# Altium project MiniPC MB GOST.PrjPcb (part 13 of 31)

## Sheet Converter 3V3-VADJ.SchDoc
size 420 x 297 mm; Author: ALTIUM GOSTBOM2.0 KEV; SheetNumber: 42; SheetTotal: 48
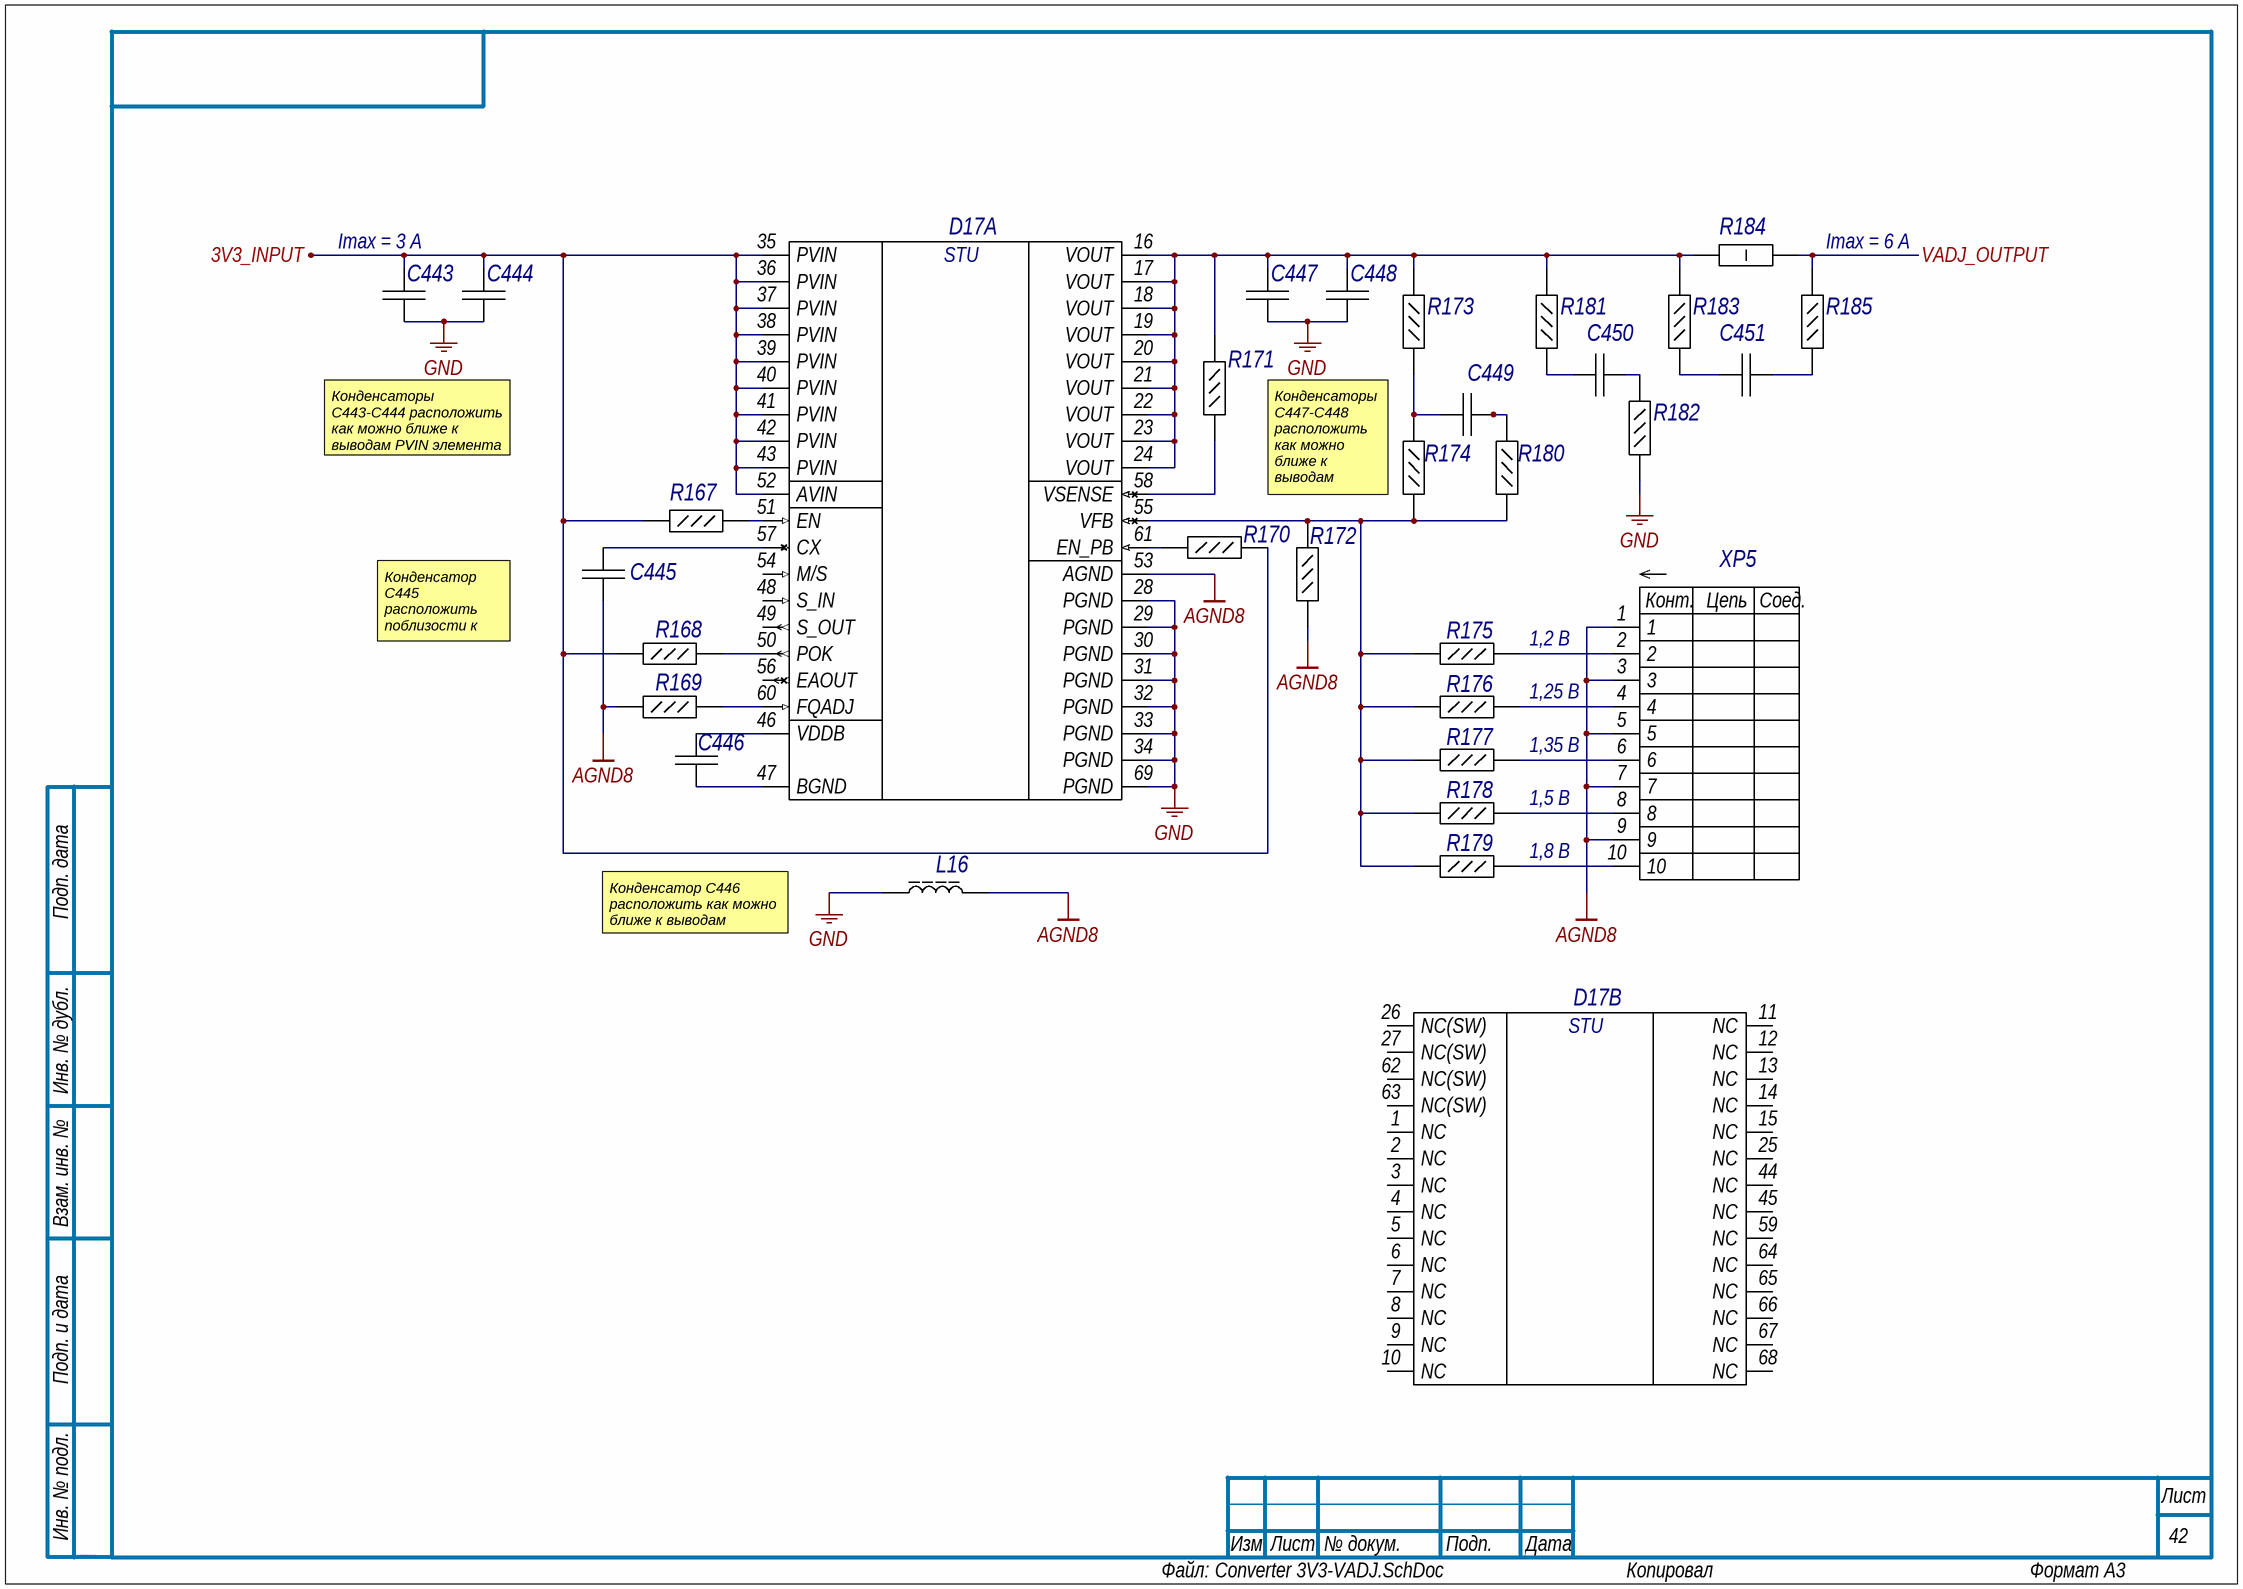
[diagram p16: Converter 3V3-VADJ.SchDoc]

### Parts
C443  GRM31CR61E226KE15L  [CAPC3216X180X55ML20T25]  (value not drawn)
C444  GRM31CR61E226KE15L  [CAPC3216X180X55ML20T25]  (value not drawn)
C445  VJ0402Y153JXQPW1BC  [CAPC1005X55X23ML05T8]  (value not drawn)
C446  GRM155R61A224KE19D  [CAPC1005X55X25NL05T10]  (value not drawn)
C447  C3216X5R1A476M160AB  [CAPC3216X180X20ML20]  (value not drawn)
C448  C3216X5R1A476M160AB  [CAPC3216X180X20ML20]  (value not drawn)
C449  C1005C0G1H220J050BA  [CAPC1005X55X10LL05]  (value not drawn)
C450  GRM155R61A224KE19D  [CAPC1005X55X25NL05T10]  (value not drawn)
C451  CGB2A1X5R1E105K033BC  [CAPC1005X33X10LL5]  (value not drawn)
D17  EN6360QI  [ALTR-QFN-68_A-305_V]  (value not drawn)  (parts A,B of 2)
L16  742792609  [SMD-0603]  (value not drawn)
R167  ERJ-2GE0R00X  [RESC1005X40X25LL05T05]  (value not drawn)
R168  ERJ-2RKF1003X  [RESC1005X40X25LL05T05]  (value not drawn)
R169  ERJ-2RKF5491X  [RESC1005X40X25LL05T05]  (value not drawn)
R170  ERJ-2RKF1002X  [RESC1005X40X25LL05T05]  (value not drawn)
R171  ERJ-2GE0R00X  [RESC1005X40X25LL05T05]  (value not drawn)
R172  CRCW0402191KFKED  [RESC1005X40X25LL05T05]  (value not drawn)
R173  ERJ-2GE0R00X  [RESC1005X40X25LL05T05]  (value not drawn)
R174  CRCW0402160KFKED  [RESC1005X40X25LL05T05]  (value not drawn)
R175  CRCW0402976KFKED  [RESC1005X40X25LL05T05]  (value not drawn)
R176  CRCW0402649KFKED  [RESC1005X40X25LL05T05]  (value not drawn)
R177  CRCW0402390KFKED  [RESC1005X40X25LL05T05]  (value not drawn)
R178  ERJ-2RKF2403X  [RESC1005X40X25LL05T05]  (value not drawn)
R179  CRCW0402137KFKED  [RESC1005X40X25LL05T05]  (value not drawn)
R180  ERJ-2RKF1502X  [RESC1005X40X25LL05T05]  (value not drawn)
R181  ERJ-2RKF1000X  [RESC1005X40X25LL05T05]  (value not drawn)
R182  ERJ-2RKF1000X  [RESC1005X40X25LL05T05]  (value not drawn)
R183  ERJ-2RKF1002X  [RESC1005X40X25LL05T05]  (value not drawn)
R184  WSLP12061L000FEA  [RESC3216X89X104LL25T25]  (value not drawn)
R185  ERJ-2RKF1002X  [RESC1005X40X25LL05T05]  (value not drawn)
XP5  TSM-105-01-T-DV-TR  [SMTC-TSM-105-01-T-DV_V]  (value not drawn)

### Ports
3V3_INPUT, VADJ_OUTPUT

### Nets
AGND8: C445.1 D17.53(AGND) L16.2 R169.2 R172.1 XP5.1 XP5.3 XP5.5 XP5.7 XP5.9
GND: C443.1 C444.1 C447.1 C448.1 D17.28(PGND) D17.29(PGND) D17.30(PGND) D17.31(PGND) D17.32(PGND) D17.33(PGND) D17.34(PGND) D17.69(PGND) L16.1 R182.1
3V3_OUTPUT: C443.2 C444.2 D17.35(PVIN) D17.36(PVIN) D17.37(PVIN) D17.38(PVIN) D17.39(PVIN) D17.40(PVIN) D17.41(PVIN) D17.42(PVIN) D17.43(PVIN) D17.52(AVIN) R167.2 R168.2 R170.1 ; port 3V3_INPUT
VADJ: R184.1 R185.2 ; port VADJ_OUTPUT
NetC445_2: C445.2 D17.57(CX)
NetC446_1: C446.1 D17.47(BGND)
NetC446_2: C446.2 D17.46(VDDB)
NetC447_2: C447.2 C448.2 D17.16(VOUT) D17.17(VOUT) D17.18(VOUT) D17.19(VOUT) D17.20(VOUT) D17.21(VOUT) D17.22(VOUT) D17.23(VOUT) D17.24(VOUT) R171.2 R173.1 R181.1 R183.2 R184.2
NetC449_1: C449.1 R173.2 R174.1
NetC449_2: C449.2 R180.1
NetC450_1: C450.1 R181.2
NetC450_2: C450.2 R182.2
NetC451_1: C451.1 R185.1
NetC451_2: C451.2 R183.1
NetD17_50: D17.50(POK) R168.1
NetD17_51: D17.51(EN) R167.1
NetD17_55: D17.55(VFB) R172.2 R174.2 R175.2 R176.2 R177.2 R178.2 R179.2 R180.2
NetD17_58: D17.58(VSENSE) R171.1
NetD17_60: D17.60(FQADJ) R169.1
NetD17_61: D17.61(EN_PB) R170.2
NetR175_1: R175.1 XP5.2
NetR176_1: R176.1 XP5.4
NetR177_1: R177.1 XP5.6
NetR178_1: R178.1 XP5.8
NetR179_1: R179.1 XP5.10

Not connected (* = marked no-connect by the designer): D17 1(NC) 2(NC) 3(NC) 4(NC) 5(NC) 6(NC) 7(NC) 8(NC) 9(NC) 10(NC) 11(NC) 12(NC) 13(NC) 14(NC) 15(NC) 25(NC) 26(NC(SW)) 27(NC(SW)) 44(NC) 45(NC) 48(S_IN) 49(S_OUT) 54(M/S) 56(EAOUT) 59(NC) 62(NC(SW)) 63(NC(SW)) 64(NC) 65(NC) 66(NC) 67(NC) 68(NC)

### Notes on the sheet
- Imax = 3 А
- Imax = 6 А
- Конденсаторы C443-C444 расположить как можно ближе к выводам PVIN элемента D17.
- Конденсаторы C447-C448 расположить как можно ближе к выводам PVOUT элемента D17.
- Конденсатор C445 расположить поблизости к D17:57.
- 1,2 В
- 1,25 В
- 1,35 В
- 1,5 В
- 1,8 В
- Конденсатор C446 расположить как можно ближе к выводам D17:46-D17:47.
- Подп. дата
- Инв. № дубл.
- Взам. инв. №
- Подп. и дата
- Инв. № подл.
- Изм.
- Лист
- № докум.
- Подп.
- Дата
- ALTIUM GOSTBOM2.0 KEV
- Файл:
- Копировал
- Формат А3
- (in symbol E39) Конт.; Цепь; Соед.
- (in symbol E106, part A) STU
- (in symbol E106, part B) STU

### Library data of the parts
C443 = E5: Chip Capacitor, 22 uF, +/- 10%, 25 V, -55 to 85 degC, 1206 (3216 Metric), RoHS, Tape and Reel; Тип элемента: Конденсатор; Capacitance: 22 uF; Case\/Package: 1206; Type (Capacitors): X5R; Voltage Rating: 25 V; Old_des: C37; New_des: C363; UID: E5; Component Kind: Standard; Case Code (Imperial): 1206; Case Code (Metric): 3216; ComponentLink1Description: Manufacturer URL; ComponentLink1URL: http://www.murata.com/; ComponentLink2Description: Datasheet; ComponentLink2URL: http://search.murata.co.jp/Ceramy/image/img/A01X/G101/ENG/GRM31CR61E226KE15-01.pdf; DatasheetVersion: 03/2016; Length: 3.2 mm; Max Operating Temperature: 85 degC; Min Operating Temperature: -55 degC; Mounting Technology: Surface Mount; Package Quantity: 2000; PackageDescription: 2-Pin Surface Mount Device, Body 3.2 x 1.6 mm; Packaging: Tape and Reel; PartNumber: GRM31CR61E226KE15L; RoHSCompliant: true; Tolerance: 10%; Width: 1.6 mm; Height: 1.6 mm; Mount: Surface Mount; PackageReference: 1206; Pins: 2; Radiation Hardening: No; REACH SVHC: No SVHC; Voltage Rating (DC): 25 V
C444 = E5: Chip Capacitor, 22 uF, +/- 10%, 25 V, -55 to 85 degC, 1206 (3216 Metric), RoHS, Tape and Reel; Тип элемента: Конденсатор; Capacitance: 22 uF; Case\/Package: 1206; Type (Capacitors): X5R; Voltage Rating: 25 V; Old_des: C38; New_des: C364; UID: E5; Component Kind: Standard; Case Code (Imperial): 1206; Case Code (Metric): 3216; ComponentLink1Description: Manufacturer URL; ComponentLink1URL: http://www.murata.com/; ComponentLink2Description: Datasheet; ComponentLink2URL: http://search.murata.co.jp/Ceramy/image/img/A01X/G101/ENG/GRM31CR61E226KE15-01.pdf; DatasheetVersion: 03/2016; Length: 3.2 mm; Max Operating Temperature: 85 degC; Min Operating Temperature: -55 degC; Mounting Technology: Surface Mount; Package Quantity: 2000; PackageDescription: 2-Pin Surface Mount Device, Body 3.2 x 1.6 mm; Packaging: Tape and Reel; PartNumber: GRM31CR61E226KE15L; RoHSCompliant: true; Tolerance: 10%; Width: 1.6 mm; Height: 1.6 mm; Mount: Surface Mount; PackageReference: 1206; Pins: 2; Radiation Hardening: No; REACH SVHC: No SVHC; Voltage Rating (DC): 25 V
C445 = E8: Chip Capacitor, 15 nF, +/- 5%, 10 V, -55 to 125 degC, 0402 (1005 Metric), RoHS, Tape and Reel; Тип элемента: Конденсатор; Capacitance: 15 nF; Case\/Package: 0402; Type (Capacitors): X7R; Voltage Rating: 10 V; Old_des: C42; New_des: C365; UID: E8; Component Kind: Standard; Case Code (Imperial): 0402; Case Code (Metric): 1005; ComponentLink1Description: Manufacturer URL; ComponentLink1URL: http://www.vishay.com/; ComponentLink2Description: Datasheet; ComponentLink2URL: http://www.vishay.com/docs/28548/vjw1bcbascomseries.pdf; DatasheetVersion: 07/2016; Length: 1 mm; Max Operating Temperature: 125 degC; Min Operating Temperature: -55 degC; Mounting Technology: Surface Mount; Package Quantity: 50000; PackageDescription: 2-Pin Surface Mount Device, Body 1 x 0.5 mm; Packaging: Tape and Reel; PartNumber: VJ0402Y153JXQPW1BC; RoHSCompliant: true; Tolerance: 5%; Width: 0.5 mm; Height: 0.5 mm; Mount: Surface Mount; PackageReference: 0402; Pins: 2; Voltage Rating (DC): 10 V
C446 = E7: Chip Capacitor, 220 nF, +/- 10%, 10 V, -55 to 85 degC, 0402 (1005 Metric), RoHS, Tape and Reel; Manufacturer: Basic Passives; Тип элемента: Конденсатор; Capacitance: 220 nF; Case\/Package: 0402; Type (Capacitors): X5R; Voltage Rating: 10 V; Old_des: C43; New_des: C366; UID: E7; Component Kind: Standard; Case Code (Imperial): 0402; Case Code (Metric): 1005; ComponentLink1Description: Manufacturer URL; ComponentLink1URL: http://www.murata.com/; ComponentLink2Description: Datasheet; ComponentLink2URL: http://search.murata.co.jp/Ceramy/image/img/A01X/G101/ENG/GRM155R61A224KE19-01.pdf; DatasheetVersion: 03/2016; Length: 1 mm; Max Operating Temperature: 85 degC; Min Operating Temperature: -55 degC; Mounting Technology: Surface Mount; Package Quantity: 1; PackageDescription: 2-Pin Surface Mount Device, Body 1 x 0.5 mm; Packaging: Tape and Reel; PartNumber: GRM155R61A224KE19D; RoHSCompliant: true; Tolerance: 10%; Width: 0.5 mm; Height: 0.5 mm; Mount: Surface Mount; PackageReference: 0402; Pins: 2; Radiation Hardening: No; REACH SVHC: No SVHC; Voltage Rating (DC): 10 V
C447 = E6: Chip Capacitor, 47 uF, +/- 20%, 10 V, -55 to 85 degC, 1206 (3216 Metric), RoHS, Tape and Reel; Тип элемента: Конденсатор; Capacitance: 47 uF; Case\/Package: 1206; Type (Capacitors): X5R; Voltage Rating: 10 V; Old_des: C39; New_des: C367; UID: E6; Component Kind: Standard; Case Code (Imperial): 1206; Case Code (Metric): 3216; ComponentLink1Description: Manufacturer URL; ComponentLink1URL: http://www.tdk.com/; ComponentLink2Description: Datasheet; ComponentLink2URL: https://product.tdk.com/info/en/catalog/datasheets/mlcc_commercial_general_en.pdf; DatasheetVersion: 03/2015; Length: 3.2 mm; Max Operating Temperature: 85 degC; Min Operating Temperature: -55 degC; Mounting Technology: Surface Mount; Package Quantity: 2000; PackageDescription: 2-Pin Surface Mount Device, Body 3.2 x 1.6 mm; Packaging: Tape and Reel; RoHSCompliant: true; Tolerance: 20%; Width: 1.6 mm; Height: 1.6 mm; Mount: Surface Mount; PackageReference: 3216; Radiation Hardening: No; Voltage Rating (DC): 10 V
C448 = E6: Chip Capacitor, 47 uF, +/- 20%, 10 V, -55 to 85 degC, 1206 (3216 Metric), RoHS, Tape and Reel; Тип элемента: Конденсатор; Capacitance: 47 uF; Case\/Package: 1206; Type (Capacitors): X5R; Voltage Rating: 10 V; Old_des: C40; New_des: C368; UID: E6; Component Kind: Standard; Case Code (Imperial): 1206; Case Code (Metric): 3216; ComponentLink1Description: Manufacturer URL; ComponentLink1URL: http://www.tdk.com/; ComponentLink2Description: Datasheet; ComponentLink2URL: https://product.tdk.com/info/en/catalog/datasheets/mlcc_commercial_general_en.pdf; DatasheetVersion: 03/2015; Length: 3.2 mm; Max Operating Temperature: 85 degC; Min Operating Temperature: -55 degC; Mounting Technology: Surface Mount; Package Quantity: 2000; PackageDescription: 2-Pin Surface Mount Device, Body 3.2 x 1.6 mm; Packaging: Tape and Reel; RoHSCompliant: true; Tolerance: 20%; Width: 1.6 mm; Height: 1.6 mm; Mount: Surface Mount; PackageReference: 3216; Radiation Hardening: No; Voltage Rating (DC): 10 V
C449 = E4: Chip Capacitor, 22 pF, +/- 5%, 50 V, -55 to 125 degC, 0402 (1005 Metric), RoHS, Tape and Reel; Тип элемента: Конденсатор; Capacitance: 22 pF; Case\/Package: 0402; Type (Capacitors): C0G; Voltage Rating: 50 V; Old_des: C36; New_des: C369; UID: E4; Component Kind: Standard; Case Code (Imperial): 0402; Case Code (Metric): 1005; ComponentLink1Description: Manufacturer URL; ComponentLink1URL: http://www.tdk.com/; ComponentLink2Description: Datasheet; ComponentLink2URL: https://product.tdk.com/info/en/catalog/datasheets/mlcc_commercial_general_en.pdf; DatasheetVersion: 08/2016; Length: 1 mm; Max Operating Temperature: 125 degC; Min Operating Temperature: -55 degC; Mounting Technology: Surface Mount; Package Quantity: 10000; PackageDescription: 2-Pin Surface Mount Device, Body 1 x 0.5 mm; Packaging: Tape and Reel; PartNumber: C1005C0G1H220J050BA; RoHSCompliant: true; Tolerance: 5%; Width: 0.5 mm; Height: 0.5 mm; Mount: Surface Mount; PackageReference: 0402; Pins: 2; Radiation Hardening: No; REACH SVHC: No SVHC; Voltage Rating (DC): 50 V
C450 = E7: Chip Capacitor, 220 nF, +/- 10%, 10 V, -55 to 85 degC, 0402 (1005 Metric), RoHS, Tape and Reel; Manufacturer: Basic Passives; Тип элемента: Конденсатор; Capacitance: 220 nF; Case\/Package: 0402; Type (Capacitors): X5R; Voltage Rating: 10 V; Old_des: C41; New_des: C370; UID: E7; Component Kind: Standard; Case Code (Imperial): 0402; Case Code (Metric): 1005; ComponentLink1Description: Manufacturer URL; ComponentLink1URL: http://www.murata.com/; ComponentLink2Description: Datasheet; ComponentLink2URL: http://search.murata.co.jp/Ceramy/image/img/A01X/G101/ENG/GRM155R61A224KE19-01.pdf; DatasheetVersion: 03/2016; Length: 1 mm; Max Operating Temperature: 85 degC; Min Operating Temperature: -55 degC; Mounting Technology: Surface Mount; Package Quantity: 1; PackageDescription: 2-Pin Surface Mount Device, Body 1 x 0.5 mm; Packaging: Tape and Reel; PartNumber: GRM155R61A224KE19D; RoHSCompliant: true; Tolerance: 10%; Width: 0.5 mm; Height: 0.5 mm; Mount: Surface Mount; PackageReference: 0402; Pins: 2; Radiation Hardening: No; REACH SVHC: No SVHC; Voltage Rating (DC): 10 V
C451 = E2: Chip Capacitor, 1 uF, +/- 10%, 25 V, -55 to 85 degC, 0402 (1005 Metric), RoHS, Tape and Reel; Тип элемента: Конденсатор; Capacitance: 1 uF; Old_des: C35; New_des: C371; UID: E2; Component Kind: Standard; Case Code (Imperial): 0402; Case Code (Metric): 1005; Case/Package: 0402; ComponentLink1Description: Manufacturer URL; ComponentLink1URL: http://www.tdk.com/; ComponentLink2Description: Datasheet; ComponentLink2URL: https://product.tdk.com/info/en/catalog/datasheets/mlcc_commercial_lowprofile_en.pdf; DatasheetVersion: 04/2015; Length: 0.039 inch; Max Operating Temperature: 85 degC; Min Operating Temperature: -55 degC; Mounting Technology: Surface Mount; Package Quantity: 1; PackageDescription: 2-Pin Surface Mount Device, Body 1 x 0.5 mm; Packaging: Tape and Reel; PartNumber: CGB2A1X5R1E105K033BC; RoHSCompliant: True; Tolerance: 10%; Width: 0.02 inch
D17 = E106: PowerSoC Highly Integrated Synchronous DC-DC Buck with Integrated Inductor, 2.5 to 6.6 V Input, -40 to 85 degC, 68-Pin QFN, RoHS, Tape and Reel; Тип элемента: Стабилизатор; Output Current: 8 A; Old_des: U5; New_des: D11; UID: E106; Component Kind: Standard; ComponentLink1Description: Manufacturer URL; ComponentLink1URL: https://www.altera.com/; ComponentLink2Description: Datasheet; ComponentLink2URL: https://www.altera.com/content/dam/altera-www/global/en_US/pdfs/literature/ds/en6360qi_06489.pdf; DatasheetVersion: Rev. G; Length: 0.43 inch; Max Operating Temperature: 85 degC; Min Operating Temperature: -40 degC; Mounting Technology: Surface Mount; Package Quantity: 250; PackageDescription: 68-Pin Quad-Flat No-Leads Package, Body 11 x 8 mm, Pitch 0.5 mm; Packaging: Tape and Reel; PartNumber: EN6360QI; RoHSCompliant: True; Width: 0.32 inch; Height: 0.12 inch; Mount: Surface Mount; Pins: 68; Radiation Hardening: No; Code_JEDEC: J-STD-020A; ComponentLink3Description: Package Specification; ComponentLink3URL: http://wl.altera.com/literature/ds/EN6360QA_10396.pdf; PackageVersion: Rev. A, 10/2014
L16 = E45: SMD EMI Suppression Ferrite Bead WE-CBF, Z = 30 Ohm; Тип элемента: Ферритовый дроссель; Impedance: 30 Ohm; Old_des: L4; New_des: L9; UID: E45; Component Kind: Standard; ComponentLink1Description: Manufacturer Link; ComponentLink1URL: http://www.we-online.com; ComponentLink2Description: Datasheet; ComponentLink2URL: http://www.we-online.de/katalog/media/pdf/742792609.pdf; DatasheetVersion: Dec-2005; PackageDescription: Chip Inductor, 2-Leads, Body 1.6 x 0.8 mm; PackageReference: SMD-0603; PackageVersion: 2009
R167 = E64: Chip Resistor, 0 mOhm, +/- 5%, 100 mW, -55 to 155 degC, 0402 (1005 Metric), RoHS, Tape and Reel; Manufacturer: Basic Passives; Тип элемента: Резистор; Case\/Package: 0402; Voltage Rating: 50 V; Power Rating: 100 mW; Resistance: 0 mOhm; Old_des: R74; New_des: R89; UID: E64; Component Kind: Standard; Case Code (Imperial): 0402; Case Code (Metric): 1005; ComponentLink1Description: Manufacturer URL; ComponentLink1URL: http://www.panasonic.com/; ComponentLink2Description: Datasheet; ComponentLink2URL: http://industrial.panasonic.com/cdbs/www-data/pdf/RDA0000/AOA0000C84.pdf; DatasheetVersion: 03/2015; Length: 1 mm; Max Operating Temperature: 155 degC; Min Operating Temperature: -55 degC; Mounting Technology: Surface Mount; Package Quantity: 10000; PackageDescription: 2-Pin Surface Mount Device, Body 1 x 0.5 mm; Packaging: Tape and Reel; PartNumber: ERJ-2GE0R00X; RoHSCompliant: true; Tolerance: 5%; Width: 0.5 mm; Height: 0.35 mm; Mount: Surface Mount; PackageReference: 0402; Pins: 2; Radiation Hardening: No; REACH SVHC: Unknown
R168 = E58: Chip Resistor, 100 KOhm, +/- 1%, 100 mW, -55 to 155 degC, 0402 (1005 Metric), RoHS, Tape and Reel; Manufacturer: Basic Passives; Тип элемента: Резистор; Case\/Package: 0402; Voltage Rating: 50 V; Power Rating: 100 mW; Old_des: R77; New_des: R90; UID: E58; Component Kind: Standard; Case Code (Imperial): 0402; Case Code (Metric): 1005; ComponentLink1Description: Manufacturer URL; ComponentLink1URL: http://www.panasonic.com/; ComponentLink2Description: Datasheet; ComponentLink2URL: http://industrial.panasonic.com/cdbs/www-data/pdf/RDA0000/AOA0000C86.pdf; DatasheetVersion: 04/2015; Length: 1 mm; Max Operating Temperature: 155 degC; Min Operating Temperature: -55 degC; Mounting Technology: Surface Mount; Package Quantity: 10000; PackageDescription: 2-Pin Surface Mount Device, Body 1 x 0.5 mm; Packaging: Tape and Reel; PartNumber: ERJ-2RKF1003X; RoHSCompliant: true; Tolerance: 1%; Width: 0.5 mm; Height: 0.35 mm; Mount: Surface Mount; PackageReference: 0402; Pins: 2; Radiation Hardening: No; REACH SVHC: Yes; Resistance: 100 KOhm
R169 = E74: Chip Resistor, 5.49 KOhm, +/- 1%, 100 mW, -55 to 155 degC, 0402 (1005 Metric), RoHS, Tape and Reel; Manufacturer: Basic Passives; Тип элемента: Резистор; Case\/Package: 0402; Voltage Rating: 50 V; Power Rating: 100 mW; Old_des: R79; New_des: R88; UID: E74; Component Kind: Standard; Case Code (Imperial): 0402; Case Code (Metric): 1005; ComponentLink1Description: Manufacturer URL; ComponentLink1URL: http://www.panasonic.com/; ComponentLink2Description: Datasheet; ComponentLink2URL: http://industrial.panasonic.com/cdbs/www-data/pdf/RDA0000/AOA0000C86.pdf; DatasheetVersion: 04/2015; Length: 0.039 inch; Max Operating Temperature: 155 degC; Min Operating Temperature: -55 degC; Mounting Technology: Surface Mount; Package Quantity: 10000; PackageDescription: 2-Pin Surface Mount Device, Body 1 x 0.5 mm; Packaging: Tape and Reel; PartNumber: ERJ-2RKF5491X; RoHSCompliant: true; Tolerance: 1%; Width: 0.02 inch; Height: 0.016 inch; Mount: Surface Mount; PackageReference: 0402; Pins: 2; REACH SVHC: Yes; Resistance: 5.49 KOhm
R170 = E60: Chip Resistor, 10 KOhm, +/- 1%, 100 mW, -55 to 155 degC, 0402 (1005 Metric), RoHS, Tape and Reel; Manufacturer: Basic Passives; Тип элемента: Резистор; Case\/Package: 0402; Voltage Rating: 50 V; Power Rating: 100 mW; Resistance: 10 KOhm; Old_des: R75; New_des: R91; UID: E60; Component Kind: Standard; Case Code (Imperial): 0402; Case Code (Metric): 1005; ComponentLink1Description: Manufacturer URL; ComponentLink1URL: http://www.panasonic.com/; ComponentLink2Description: Datasheet; ComponentLink2URL: http://industrial.panasonic.com/cdbs/www-data/pdf/RDA0000/AOA0000C86.pdf; DatasheetVersion: 04/2015; Length: 1 mm; Max Operating Temperature: 155 degC; Min Operating Temperature: -55 degC; Mounting Technology: Surface Mount; Package Quantity: 10000; PackageDescription: 2-Pin Surface Mount Device, Body 1 x 0.5 mm; Packaging: Tape and Reel; PartNumber: ERJ-2RKF1002X; RoHSCompliant: true; Tolerance: 1%; Width: 0.5 mm; Height: 0.35 mm; Mount: Surface Mount; PackageReference: 0402; Pins: 2; Radiation Hardening: No; REACH SVHC: Yes
R171 = E64: Chip Resistor, 0 mOhm, +/- 5%, 100 mW, -55 to 155 degC, 0402 (1005 Metric), RoHS, Tape and Reel; Manufacturer: Basic Passives; Тип элемента: Резистор; Case\/Package: 0402; Voltage Rating: 50 V; Power Rating: 100 mW; Resistance: 0 mOhm; Old_des: R71; New_des: R92; UID: E64; Component Kind: Standard; Case Code (Imperial): 0402; Case Code (Metric): 1005; ComponentLink1Description: Manufacturer URL; ComponentLink1URL: http://www.panasonic.com/; ComponentLink2Description: Datasheet; ComponentLink2URL: http://industrial.panasonic.com/cdbs/www-data/pdf/RDA0000/AOA0000C84.pdf; DatasheetVersion: 03/2015; Length: 1 mm; Max Operating Temperature: 155 degC; Min Operating Temperature: -55 degC; Mounting Technology: Surface Mount; Package Quantity: 10000; PackageDescription: 2-Pin Surface Mount Device, Body 1 x 0.5 mm; Packaging: Tape and Reel; PartNumber: ERJ-2GE0R00X; RoHSCompliant: true; Tolerance: 5%; Width: 0.5 mm; Height: 0.35 mm; Mount: Surface Mount; PackageReference: 0402; Pins: 2; Radiation Hardening: No; REACH SVHC: Unknown
R172 = E73: Chip Resistor, 191 KOhm, +/- 1%, 63 mW, -55 to 155 degC, 0402 (1005 Metric), RoHS, Tape and Reel; Manufacturer: Basic Passives; Тип элемента: Резистор; Case\/Package: 0402; Voltage Rating: 50 V; Power Rating: 63 mW; Old_des: R63; New_des: R93; UID: E73; Component Kind: Standard; Case Code (Imperial): 0402; Case Code (Metric): 1005; ComponentLink1Description: Manufacturer URL; ComponentLink1URL: http://www.vishay.com/; ComponentLink2Description: Datasheet; ComponentLink2URL: http://www.vishay.com/docs/20035/dcrcwe3.pdf; DatasheetVersion: 06/2012; Length: 1 mm; Max Operating Temperature: 155 degC; Min Operating Temperature: -55 degC; Mounting Technology: Surface Mount; Package Quantity: 10000; PackageDescription: 2-Pin Surface Mount Device, Body 1 x 0.5 mm; Packaging: Tape and Reel; PartNumber: CRCW0402191KFKED; RoHSCompliant: true; Tolerance: 1%; Width: 0.5 mm; Height: 0.35 mm; Mount: Surface Mount; PackageReference: 0402; Pins: 2; Radiation Hardening: No; REACH SVHC: Unknown; Resistance: 191 KOhm; Weight: 2.3E-05oz
R173 = E64: Chip Resistor, 0 mOhm, +/- 5%, 100 mW, -55 to 155 degC, 0402 (1005 Metric), RoHS, Tape and Reel; Manufacturer: Basic Passives; Тип элемента: Резистор; Case\/Package: 0402; Voltage Rating: 50 V; Power Rating: 100 mW; Resistance: 0 mOhm; Old_des: R68; New_des: R94; UID: E64; Component Kind: Standard; Case Code (Imperial): 0402; Case Code (Metric): 1005; ComponentLink1Description: Manufacturer URL; ComponentLink1URL: http://www.panasonic.com/; ComponentLink2Description: Datasheet; ComponentLink2URL: http://industrial.panasonic.com/cdbs/www-data/pdf/RDA0000/AOA0000C84.pdf; DatasheetVersion: 03/2015; Length: 1 mm; Max Operating Temperature: 155 degC; Min Operating Temperature: -55 degC; Mounting Technology: Surface Mount; Package Quantity: 10000; PackageDescription: 2-Pin Surface Mount Device, Body 1 x 0.5 mm; Packaging: Tape and Reel; PartNumber: ERJ-2GE0R00X; RoHSCompliant: true; Tolerance: 5%; Width: 0.5 mm; Height: 0.35 mm; Mount: Surface Mount; PackageReference: 0402; Pins: 2; Radiation Hardening: No; REACH SVHC: Unknown
R174 = E63: Chip Resistor, 160 KOhm, +/- 1%, 63 mW, -55 to 155 degC, 0402 (1005 Metric), RoHS, Tape and Reel; Manufacturer: Basic Passives; Тип элемента: Резистор; Case\/Package: 0402; Voltage Rating: 50 V; Power Rating: 63 mW; Old_des: R66; New_des: R95; UID: E63; Component Kind: Standard; Case Code (Imperial): 0402; Case Code (Metric): 1005; ComponentLink1Description: Manufacturer URL; ComponentLink1URL: http://www.vishay.com/; ComponentLink2Description: Datasheet; ComponentLink2URL: http://www.vishay.com/docs/20035/dcrcwe3.pdf; DatasheetVersion: 06/2012; Length: 1 mm; Max Operating Temperature: 155 degC; Min Operating Temperature: -55 degC; Mounting Technology: Surface Mount; Package Quantity: 10; PackageDescription: 2-Pin Surface Mount Device, Body 1 x 0.5 mm; Packaging: Tape and Reel; PartNumber: CRCW0402160KFKED; RoHSCompliant: true; Tolerance: 1%; Width: 0.5 mm; Height: 0.35 mm; Mount: Surface Mount; PackageReference: 0402; Pins: 2; Radiation Hardening: No; REACH SVHC: Unknown; Resistance: 160 KOhm; Weight: 2.3E-05oz
R175 = E75: Chip Resistor, 976 KOhm, +/- 1%, 63 mW, -55 to 155 degC, 0402 (1005 Metric), RoHS, Tape and Reel; Manufacturer: Basic Passives; Тип элемента: Резистор; Case\/Package: 0402; Voltage Rating: 50 V; Power Rating: 63 mW; Old_des: R73; New_des: R96; UID: E75; Component Kind: Standard; Case Code (Imperial): 0402; Case Code (Metric): 1005; ComponentLink1Description: Manufacturer URL; ComponentLink1URL: http://www.vishay.com/; ComponentLink2Description: Datasheet; ComponentLink2URL: http://www.vishay.com/docs/20035/dcrcwe3.pdf; DatasheetVersion: 06/2012; Length: 1 mm; Max Operating Temperature: 155 degC; Min Operating Temperature: -55 degC; Mounting Technology: Surface Mount; Package Quantity: 10000; PackageDescription: 2-Pin Surface Mount Device, Body 1 x 0.5 mm; Packaging: Tape and Reel; PartNumber: CRCW0402976KFKED; RoHSCompliant: true; Tolerance: 1%; Width: 0.5 mm; Height: 0.35 mm; Mount: Surface Mount; PackageReference: 0402; Pins: 2; Radiation Hardening: No; REACH SVHC: Unknown; Resistance: 976 KOhm; Weight: 2.3E-05oz
R176 = E76: Chip Resistor, 649 KOhm, +/- 1%, 63 mW, -55 to 155 degC, 0402 (1005 Metric), RoHS, Tape and Reel; Manufacturer: Basic Passives; Тип элемента: Резистор; Case\/Package: 0402; Voltage Rating: 50 V; Power Rating: 63 mW; Old_des: R76; New_des: R97; UID: E76; Component Kind: Standard; Case Code (Imperial): 0402; Case Code (Metric): 1005; ComponentLink1Description: Manufacturer URL; ComponentLink1URL: http://www.vishay.com/; ComponentLink2Description: Datasheet; ComponentLink2URL: http://www.vishay.com/docs/20035/dcrcwe3.pdf; DatasheetVersion: 06/2012; Length: 1 mm; Max Operating Temperature: 155 degC; Min Operating Temperature: -55 degC; Mounting Technology: Surface Mount; Package Quantity: 10; PackageDescription: 2-Pin Surface Mount Device, Body 1 x 0.5 mm; Packaging: Tape and Reel; PartNumber: CRCW0402649KFKED; RoHSCompliant: true; Tolerance: 1%; Width: 0.5 mm; Height: 0.35 mm; Mount: Surface Mount; PackageReference: 0402; Pins: 2; Radiation Hardening: No; REACH SVHC: No SVHC; Resistance: 649 KOhm; Weight: 2.3E-05oz
R177 = E77: Chip Resistor, 390 KOhm, +/- 1%, 63 mW, -55 to 155 degC, 0402 (1005 Metric), RoHS, Tape and Reel; Manufacturer: Basic Passives; Тип элемента: Резистор; Case\/Package: 0402; Voltage Rating: 50 V; Power Rating: 63 mW; Old_des: R78; New_des: R98; UID: E77; Component Kind: Standard; Case Code (Imperial): 0402; Case Code (Metric): 1005; ComponentLink1Description: Manufacturer URL; ComponentLink1URL: http://www.vishay.com/; ComponentLink2Description: Datasheet; ComponentLink2URL: http://www.vishay.com/docs/20035/dcrcwe3.pdf; DatasheetVersion: 06/2012; Length: 1 mm; Max Operating Temperature: 155 degC; Min Operating Temperature: -55 degC; Mounting Technology: Surface Mount; Package Quantity: 10000; PackageDescription: 2-Pin Surface Mount Device, Body 1 x 0.5 mm; Packaging: Tape and Reel; PartNumber: CRCW0402390KFKED; RoHSCompliant: true; Tolerance: 1%; Width: 0.5 mm; Height: 0.35 mm; Mount: Surface Mount; PackageReference: 0402; Pins: 2; Radiation Hardening: No; REACH SVHC: Unknown; Resistance: 390 KOhm; Weight: 2.3E-05oz
R178 = E78: Chip Resistor, 240 KOhm, +/- 1%, 100 mW, -55 to 155 degC, 0402 (1005 Metric), RoHS, Tape and Reel; Manufacturer: Basic Passives; Тип элемента: Резистор; Case\/Package: 0402; Voltage Rating: 50 V; Power Rating: 100 mW; Old_des: R80; New_des: R99; UID: E78; Component Kind: Standard; Case Code (Imperial): 0402; Case Code (Metric): 1005; ComponentLink1Description: Manufacturer URL; ComponentLink1URL: http://www.panasonic.com/; ComponentLink2Description: Datasheet; ComponentLink2URL: http://industrial.panasonic.com/cdbs/www-data/pdf/RDA0000/AOA0000C86.pdf; DatasheetVersion: 04/2015; Length: 1 mm; Max Operating Temperature: 155 degC; Min Operating Temperature: -55 degC; Mounting Technology: Surface Mount; Package Quantity: 10000; PackageDescription: 2-Pin Surface Mount Device, Body 1 x 0.5 mm; Packaging: Tape and Reel; PartNumber: ERJ-2RKF2403X; RoHSCompliant: true; Tolerance: 1%; Width: 0.5 mm; Height: 0.35 mm; Mount: Surface Mount; PackageReference: 0402; Pins: 2; Radiation Hardening: No; REACH SVHC: Unknown; Resistance: 240 KOhm
R179 = E79: Chip Resistor, 137 KOhm, +/- 1%, 63 mW, -55 to 155 degC, 0402 (1005 Metric), RoHS, Tape and Reel; Manufacturer: Basic Passives; Тип элемента: Резистор; Case\/Package: 0402; Voltage Rating: 50 V; Power Rating: 63 mW; Old_des: R81; New_des: R100; UID: E79; Component Kind: Standard; Case Code (Imperial): 0402; Case Code (Metric): 1005; ComponentLink1Description: Manufacturer URL; ComponentLink1URL: http://www.vishay.com/; ComponentLink2Description: Datasheet; ComponentLink2URL: http://www.vishay.com/docs/20035/dcrcwe3.pdf; DatasheetVersion: 06/2012; Length: 1 mm; Max Operating Temperature: 155 degC; Min Operating Temperature: -55 degC; Mounting Technology: Surface Mount; Package Quantity: 10000; PackageDescription: 2-Pin Surface Mount Device, Body 1 x 0.5 mm; Packaging: Tape and Reel; PartNumber: CRCW0402137KFKED; RoHSCompliant: true; Tolerance: 1%; Width: 0.5 mm; Height: 0.35 mm; Mount: Surface Mount; PackageReference: 0402; Pins: 2; Radiation Hardening: No; REACH SVHC: Unknown; Resistance: 137 KOhm; Weight: 2.3E-05oz
R180 = E62: Chip Resistor, 15 KOhm, +/- 1%, 100 mW, -55 to 155 degC, 0402 (1005 Metric), RoHS, Tape and Reel; Manufacturer: Basic Passives; Тип элемента: Резистор; Case\/Package: 0402; Voltage Rating: 50 V; Power Rating: 100 mW; Resistance: 15 KOhm; Old_des: R64; New_des: R101; UID: E62; Component Kind: Standard; Case Code (Imperial): 0402; Case Code (Metric): 1005; ComponentLink1Description: Manufacturer URL; ComponentLink1URL: http://www.panasonic.com/; ComponentLink2Description: Datasheet; ComponentLink2URL: http://industrial.panasonic.com/cdbs/www-data/pdf/RDA0000/AOA0000C86.pdf; DatasheetVersion: 04/2015; Length: 1 mm; Max Operating Temperature: 155 degC; Min Operating Temperature: -55 degC; Mounting Technology: Surface Mount; Package Quantity: 10000; PackageDescription: 2-Pin Surface Mount Device, Body 1 x 0.5 mm; Packaging: Tape and Reel; PartNumber: ERJ-2RKF1502X; RoHSCompliant: true; Tolerance: 1%; Width: 0.5 mm; Height: 0.35 mm; Mount: Surface Mount; PackageReference: 0402; Pins: 2; Radiation Hardening: No; REACH SVHC: Yes; Weight: 2.8E-05oz
R181 = E66: Chip Resistor, 100 Ohm, +/- 1%, 100 mW, -55 to 155 degC, 0402 (1005 Metric), RoHS, Tape and Reel; Manufacturer: Basic Passives; Тип элемента: Резистор; Case\/Package: 0402; Voltage Rating: 50 V; Power Rating: 100 mW; Resistance: 100 Ohm; Old_des: R70; New_des: R102; UID: E66; Component Kind: Standard; Case Code (Imperial): 0402; Case Code (Metric): 1005; ComponentLink1Description: Manufacturer URL; ComponentLink1URL: http://www.panasonic.com/; ComponentLink2Description: Datasheet; ComponentLink2URL: http://industrial.panasonic.com/cdbs/www-data/pdf/RDA0000/AOA0000C86.pdf; DatasheetVersion: 04/2015; Length: 1 mm; Max Operating Temperature: 155 degC; Min Operating Temperature: -55 degC; Mounting Technology: Surface Mount; Package Quantity: 10000; PackageDescription: 2-Pin Surface Mount Device, Body 1 x 0.5 mm; Packaging: Tape and Reel; PartNumber: ERJ-2RKF1000X; RoHSCompliant: true; Tolerance: 1%; Width: 0.5 mm; Height: 0.35 mm; Mount: Surface Mount; PackageReference: 0402; Pins: 2; Radiation Hardening: No; REACH SVHC: Yes
R182 = E66: Chip Resistor, 100 Ohm, +/- 1%, 100 mW, -55 to 155 degC, 0402 (1005 Metric), RoHS, Tape and Reel; Manufacturer: Basic Passives; Тип элемента: Резистор; Case\/Package: 0402; Voltage Rating: 50 V; Power Rating: 100 mW; Resistance: 100 Ohm; Old_des: R72; New_des: R103; UID: E66; Component Kind: Standard; Case Code (Imperial): 0402; Case Code (Metric): 1005; ComponentLink1Description: Manufacturer URL; ComponentLink1URL: http://www.panasonic.com/; ComponentLink2Description: Datasheet; ComponentLink2URL: http://industrial.panasonic.com/cdbs/www-data/pdf/RDA0000/AOA0000C86.pdf; DatasheetVersion: 04/2015; Length: 1 mm; Max Operating Temperature: 155 degC; Min Operating Temperature: -55 degC; Mounting Technology: Surface Mount; Package Quantity: 10000; PackageDescription: 2-Pin Surface Mount Device, Body 1 x 0.5 mm; Packaging: Tape and Reel; PartNumber: ERJ-2RKF1000X; RoHSCompliant: true; Tolerance: 1%; Width: 0.5 mm; Height: 0.35 mm; Mount: Surface Mount; PackageReference: 0402; Pins: 2; Radiation Hardening: No; REACH SVHC: Yes
R183 = E60: Chip Resistor, 10 KOhm, +/- 1%, 100 mW, -55 to 155 degC, 0402 (1005 Metric), RoHS, Tape and Reel; Manufacturer: Basic Passives; Тип элемента: Резистор; Case\/Package: 0402; Voltage Rating: 50 V; Power Rating: 100 mW; Resistance: 10 KOhm; Old_des: R65; New_des: R104; UID: E60; Component Kind: Standard; Case Code (Imperial): 0402; Case Code (Metric): 1005; ComponentLink1Description: Manufacturer URL; ComponentLink1URL: http://www.panasonic.com/; ComponentLink2Description: Datasheet; ComponentLink2URL: http://industrial.panasonic.com/cdbs/www-data/pdf/RDA0000/AOA0000C86.pdf; DatasheetVersion: 04/2015; Length: 1 mm; Max Operating Temperature: 155 degC; Min Operating Temperature: -55 degC; Mounting Technology: Surface Mount; Package Quantity: 10000; PackageDescription: 2-Pin Surface Mount Device, Body 1 x 0.5 mm; Packaging: Tape and Reel; PartNumber: ERJ-2RKF1002X; RoHSCompliant: true; Tolerance: 1%; Width: 0.5 mm; Height: 0.35 mm; Mount: Surface Mount; PackageReference: 0402; Pins: 2; Radiation Hardening: No; REACH SVHC: Yes
R184 = E65: Chip Resistor, 0.001 Ohm, +/- 1%, 1 W, -65 to 170 degC, 1206 (3216 Metric), RoHS, Tape and Reel; Тип элемента: Резистор; Old_des: R69; New_des: R105; UID: E65; Component Kind: Standard; Case Code (Imperial): 1206; Case Code (Metric): 3216; Case/Package: 1206; ComponentLink1Description: Manufacturer URL; ComponentLink1URL: http://www.vishay.com/; ComponentLink2Description: Datasheet; ComponentLink2URL: http://www.farnell.com/datasheets/2049155.pdf; DatasheetVersion: 04/2015; Length: 3.2 mm; Max Operating Temperature: 170 degC; Min Operating Temperature: -65 degC; Mounting Technology: Surface Mount; PackageDescription: 2-Pin Surface Mount Device, Body 3.2 x 1.6 mm; Packaging: Tape and Reel; PartNumber: WSLP12061L000FEA; RoHSCompliant: True; Tolerance: 1%; Width: 1.6 mm; Height: 0.635 mm; REACH SVHC: Unknown; Resistance: 0.001 Ohm
R185 = E60: Chip Resistor, 10 KOhm, +/- 1%, 100 mW, -55 to 155 degC, 0402 (1005 Metric), RoHS, Tape and Reel; Manufacturer: Basic Passives; Тип элемента: Резистор; Case\/Package: 0402; Voltage Rating: 50 V; Power Rating: 100 mW; Resistance: 10 KOhm; Old_des: R67; New_des: R106; UID: E60; Component Kind: Standard; Case Code (Imperial): 0402; Case Code (Metric): 1005; ComponentLink1Description: Manufacturer URL; ComponentLink1URL: http://www.panasonic.com/; ComponentLink2Description: Datasheet; ComponentLink2URL: http://industrial.panasonic.com/cdbs/www-data/pdf/RDA0000/AOA0000C86.pdf; DatasheetVersion: 04/2015; Length: 1 mm; Max Operating Temperature: 155 degC; Min Operating Temperature: -55 degC; Mounting Technology: Surface Mount; Package Quantity: 10000; PackageDescription: 2-Pin Surface Mount Device, Body 1 x 0.5 mm; Packaging: Tape and Reel; PartNumber: ERJ-2RKF1002X; RoHSCompliant: true; Tolerance: 1%; Width: 0.5 mm; Height: 0.35 mm; Mount: Surface Mount; PackageReference: 0402; Pins: 2; Radiation Hardening: No; REACH SVHC: Yes
XP5 = E39: Male Header, Pitch 2.54 mm, 2 x 5 Position, Height 9.65 mm, -55 to 105 degC, RoHS, Tape and Reel; Тип элемента: Соединитель; Old_des: J2; New_des: XP4; UID: E39; Component Kind: Standard; ComponentLink1Description: Manufacturer URL; ComponentLink1URL: http://www.samtec.com/; ComponentLink2Description: Datasheet; ComponentLink2URL: http://suddendocs.samtec.com/catalog_english/tsm.pdf; DatasheetVersion: Rev. 31DEC15; Length: 12.7 mm; Max Operating Temperature: 105 degC; Min Operating Temperature: -55 degC; Mounting Technology: Surface Mount; PackageDescription: Male Header, Pitch 2.54 mm, 2 x 5 Position, Height 9.65 mm; Packaging: Tape and Reel; PartNumber: TSM-105-01-T-DV-TR; RoHSCompliant: True; Height: 9.65 mm; Mount: Surface Mount; Pins: 10; Radiation Hardening: No; REACH SVHC: No SVHC; ComponentLink3Description: Package Specification; ComponentLink3URL: http://suddendocs.samtec.com/prints/tsm-dv-footprint.pdf